# Altium project P1234.03.PrjPcb
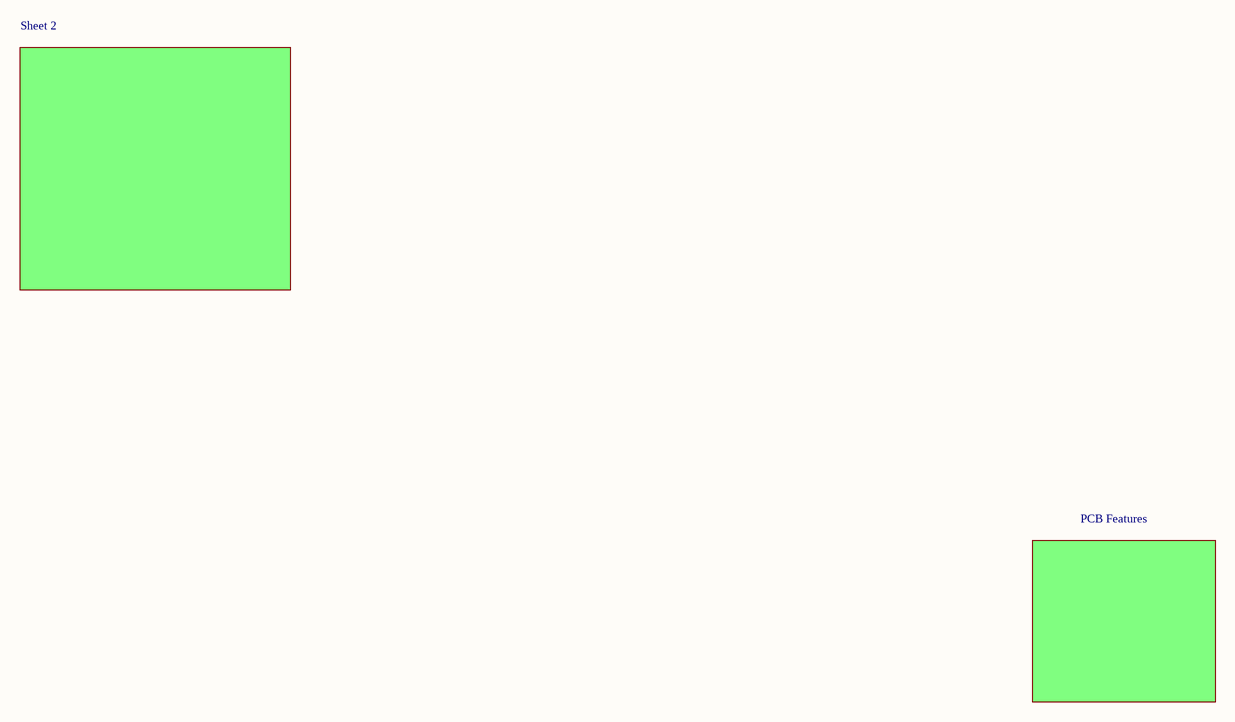
[diagram p0: P1234.01_TopLevel.SchDoc]
Schematic_Title2: Example Title 2; Schematic_Title: Example_Schematic_Title; Client_Project: P1234
2 sheets, 17 parts. Net scope: global (net labels, ports and power ports of the same name join across sheets).
Board files: P1234.02_PCB.PcbDoc, P1234.02_Panel.PcbDoc
Sheets:
  P1234.01_TopLevel.SchDoc
  P1234.01_PCB Features.SchDoc

## Sheet P1234.01_TopLevel.SchDoc
size A3; SheetNumber: 1; SheetTotal: 3; Sheet_Title: Top Level

### Sub-sheets
PCB Features = P1234.01_A1_Schematic Sheet 3 of 3.SchDoc (file not in this document): no entries
Sheet 2 = P1234.01_A1_Schematic Sheet 2 of 3.SchDoc (file not in this document): no entries

### Notes on the sheet
- Client / Project
- Issue
- ECR
- Number
- Title
- Date
- App'd
- Sheet
- Must Not Be Modified
- Without Authorisation
- Certification Drawing
- Values shown are typical, see BOM table for certification details
- !
- DENOTES SAFETY COMPONENT
- Dr'n
- TROLEX Ltd
- Newby Road, Stockport, Cheshire SK7 5DY  U.K.
- Ch'kd
- Tel: +44 (0)161-483-1435  Web:www.trolex.com  Email: info@trolex.com
- No.
- Of

## Sheet P1234.01_PCB Features.SchDoc
size A3; SheetNumber: 3; SheetTotal: 3
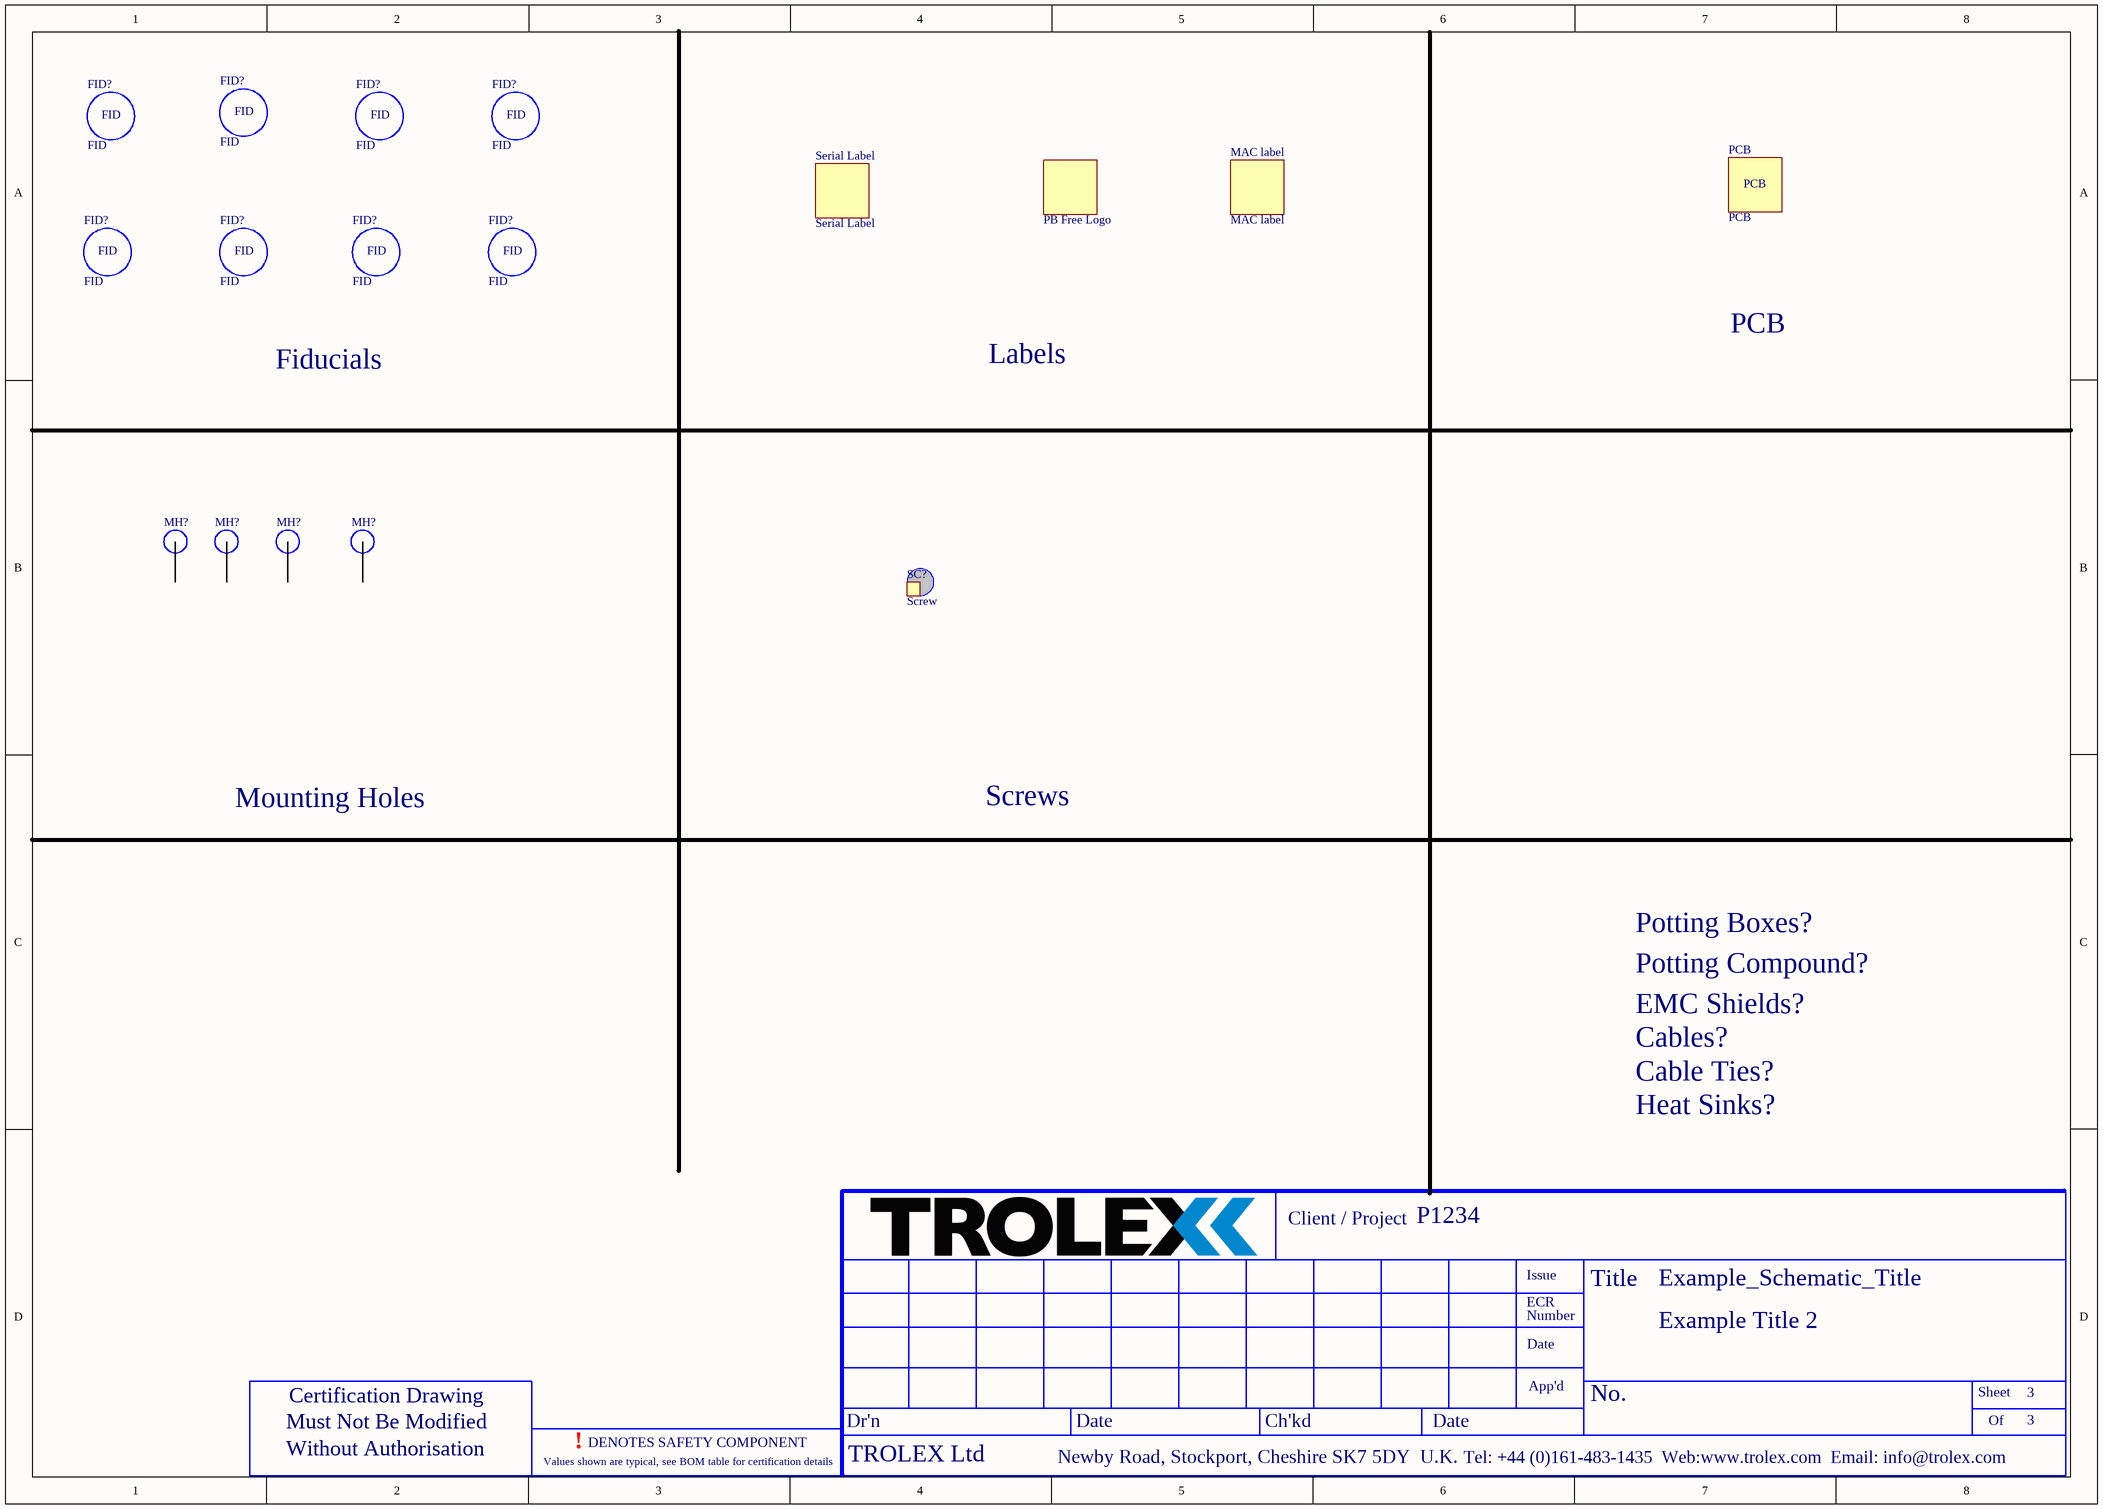
[diagram p1: P1234.01_PCB Features.SchDoc]

### Parts
(Parts that share a designator on the sheet are numbered #1, #2 ... from top to bottom, then left to right.)
FID?#1  FID  [FID]  (no BOM)
FID?#2  FID  [FID]  (no BOM)
FID?#3  FID  [FID]  (no BOM)
FID?#4  FID  [FID]  (no BOM)
FID?#5  FID  [FID]  (no BOM)
FID?#6  FID  [FID]  (no BOM)
FID?#7  FID  [FID]  (no BOM)
FID?#8  FID  [FID]  (no BOM)
MAC_label  MAC label  [MAC label 32 x 6]
MH?#1  Mounting Hole  [Mounting Hole M3]  (value not drawn)  (no BOM)
MH?#2  Mounting Hole  [Mounting Hole M3]  (value not drawn)  (no BOM)
MH?#3  Mounting Hole  [Mounting Hole M3]  (value not drawn)  (no BOM)
MH?#4  Mounting Hole  [Mounting Hole M3]  (value not drawn)  (no BOM)
PB_Free  PB Free Logo  [PB Free Logo-Footprint-1]  (no BOM)
PCB  PCB  (mechanical)
SC?  Screw  (mechanical)
Serial_Label  Serial Label  [Serial Label 19 x 6]  (no BOM)

### Nets

Not connected (* = marked no-connect by the designer): MH?#1 1; MH?#2 1; MH?#3 1; MH?#4 1

### Notes on the sheet
- Fiducials
- Labels
- PCB
- Mounting Holes
- Screws
- Potting Boxes?
- Potting Compound?
- EMC Shields?
- Cables?
- Cable Ties?
- Heat Sinks?
- Client / Project
- Issue
- ECR
- Number
- Title
- Date
- App'd
- Sheet
- Must Not Be Modified
- Without Authorisation
- Certification Drawing
- Values shown are typical, see BOM table for certification details
- !
- DENOTES SAFETY COMPONENT
- Dr'n
- TROLEX Ltd
- Newby Road, Stockport, Cheshire SK7 5DY  U.K.
- Ch'kd
- Tel: +44 (0)161-483-1435  Web:www.trolex.com  Email: info@trolex.com
- No.
- Of

### Library data of the parts
FID?#1-FID?#8 = CMP-054-000000-1: Part Number: S*; 3D Lib Path: K:\Altium\Trolex Library June 2015\Trolex 3D Components June 2015; Source: Mechanical.SchLib; Category: Connectors; Symbol ID: FID; Created By: BTS; Created Date: 04/06/2015; Design Item ID: FID; Symbol Path: K:\Altium\Trolex Library June 2015\Trolex Schematic Library Imperial\Mechanical.SchLib
MAC_label = CMP-059-000016-1: MAC address label 32 x 6; Source: Mechanical.SchLib; Design Item ID: MAC label
MH?#1-MH?#4 = CMP-054-000002-1: Part Number: S*; Symbol ID: XSUP015AY PRESSURE SENSOR; 3D Lib Path: K:\Altium\Trolex Library June 2015\Trolex 3D Components June 2015; Created Date: 04/06/2015; Design Item ID: Mounting Hole; Category: Connectors; Source: Mechanical.SchLib; Symbol Path: K:\Altium\Trolex Library June 2015\Trolex Schematic Library Imperial\Mechanical.SchLib; Created By: BTS
PB_Free = CMP-00028-00007-2: Design Item ID: PB Free; Source: Mechanical.SchLib
PCB = CMP-059-000000-1: Part Number: Pxxxx.xx; 3D Lib Path: K:\Altium\Trolex Library June 2015\Trolex 3D Components June 2015; Category: PCB; Design Item ID: PCB; Source: Mechanical.SchLib; Created By: BTS; Created Date: 27/04/2018
SC? = CMP-054-000001-1: Part Number: S*; Symbol ID: XSUP015AY PRESSURE SENSOR; 3D Lib Path: K:\Altium\Trolex Library June 2015\Trolex 3D Components June 2015; Source: Mechanical.SchLib; Created By: BTS; Design Item ID: Screw; Created Date: 04/06/2015; Symbol Path: K:\Altium\Trolex Library June 2015\Trolex Schematic Library Imperial\Mechanical.SchLib; Category: Connectors
Serial_Label = CMP-059-000023-1: Serial Label 19 x6; Design Item ID: Serial Label; Source: Mechanical.SchLib

## Assembly variants
P1234.02.CERT: all parts fitted
P1234.03.CERT: all parts fitted
Safety Critical Components: all parts fitted
P1234.02_PCB_Specification: all parts fitted
P1234.03.01: all parts fitted